# EAGLE schematic Weigh_scale1 (EAGLE 9.5.2)
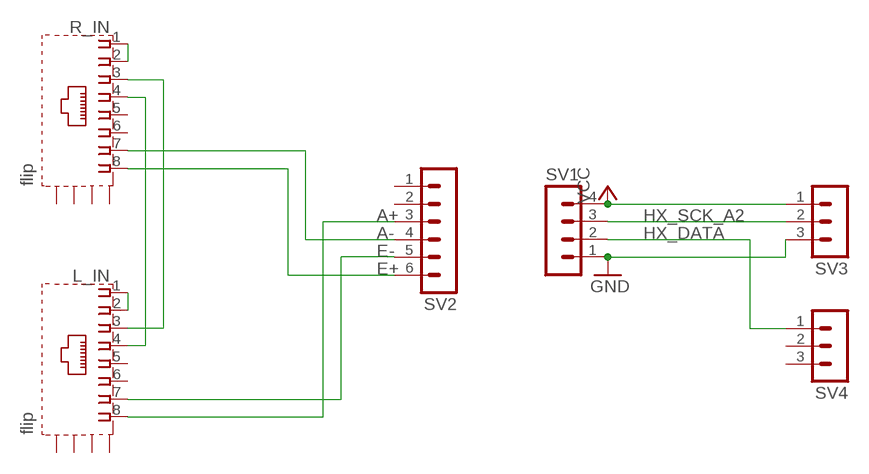
[diagram p0: schematic, sheet 1]

## Parts
L_IN  flip  RJ45-6L2-B  [RJ45-SHIELD2]
R_IN  flip  RJ45-6L2-B  [RJ45-SHIELD2]
SV1  MA04-1  [MA04-1]
SV2  MA06-1  [MA06-1]
SV3  MA03-1  [MA03-1]
SV4  MA03-1  [MA03-1]

## Nets
A+: L_IN.8 SV2.3
A-: R_IN.7 SV2.4
E+: R_IN.8 SV2.6
E-: L_IN.7 SV2.5
GND: SV1.1 SV3.3
HX_DATA: SV1.2 SV4.1
HX_SCK_A2: SV1.3 SV3.2
N$1: L_IN.1 L_IN.2
N$4: R_IN.1 R_IN.2
N$7: L_IN.3 R_IN.3
N$8: L_IN.4 R_IN.4
VCC: SV1.4 SV3.1
Unconnected: L_IN.5 L_IN.6 L_IN.S1(S) L_IN.S2(S) L_IN.S3(S) L_IN.S4(S) R_IN.5 R_IN.6 R_IN.S1(S) R_IN.S2(S) R_IN.S3(S) R_IN.S4(S) SV2.1 SV2.2 SV4.2 SV4.3

## Library data of the parts
L_IN R_IN = con-tycoelectronics:RJ45*2: RJ45 Low Profile Shield Type 2 For all RJ45 L, LC, LCT and X Series Models Source: www.tycoelectronics.com .. ENG_DS_1654001_1099_RJ_L_0507.pdf; MPN: RJ45-6L2-B; OC_FARNELL: unknown; OC_NEWARK: 16R6096
SV1 = con-lstb:MA04-1: PIN HEADER; OC_FARNELL: unknown; OC_NEWARK: unknown
SV2 = con-lstb:MA06-1: PIN HEADER; OC_FARNELL: unknown; OC_NEWARK: unknown
SV3 SV4 = con-lstb:MA03-1: PIN HEADER; OC_FARNELL: unknown; OC_NEWARK: unknown